# Altium schematic sheet CP80 Preamp.SchDoc
size D; SheetNumber: 1; SheetTotal: 1
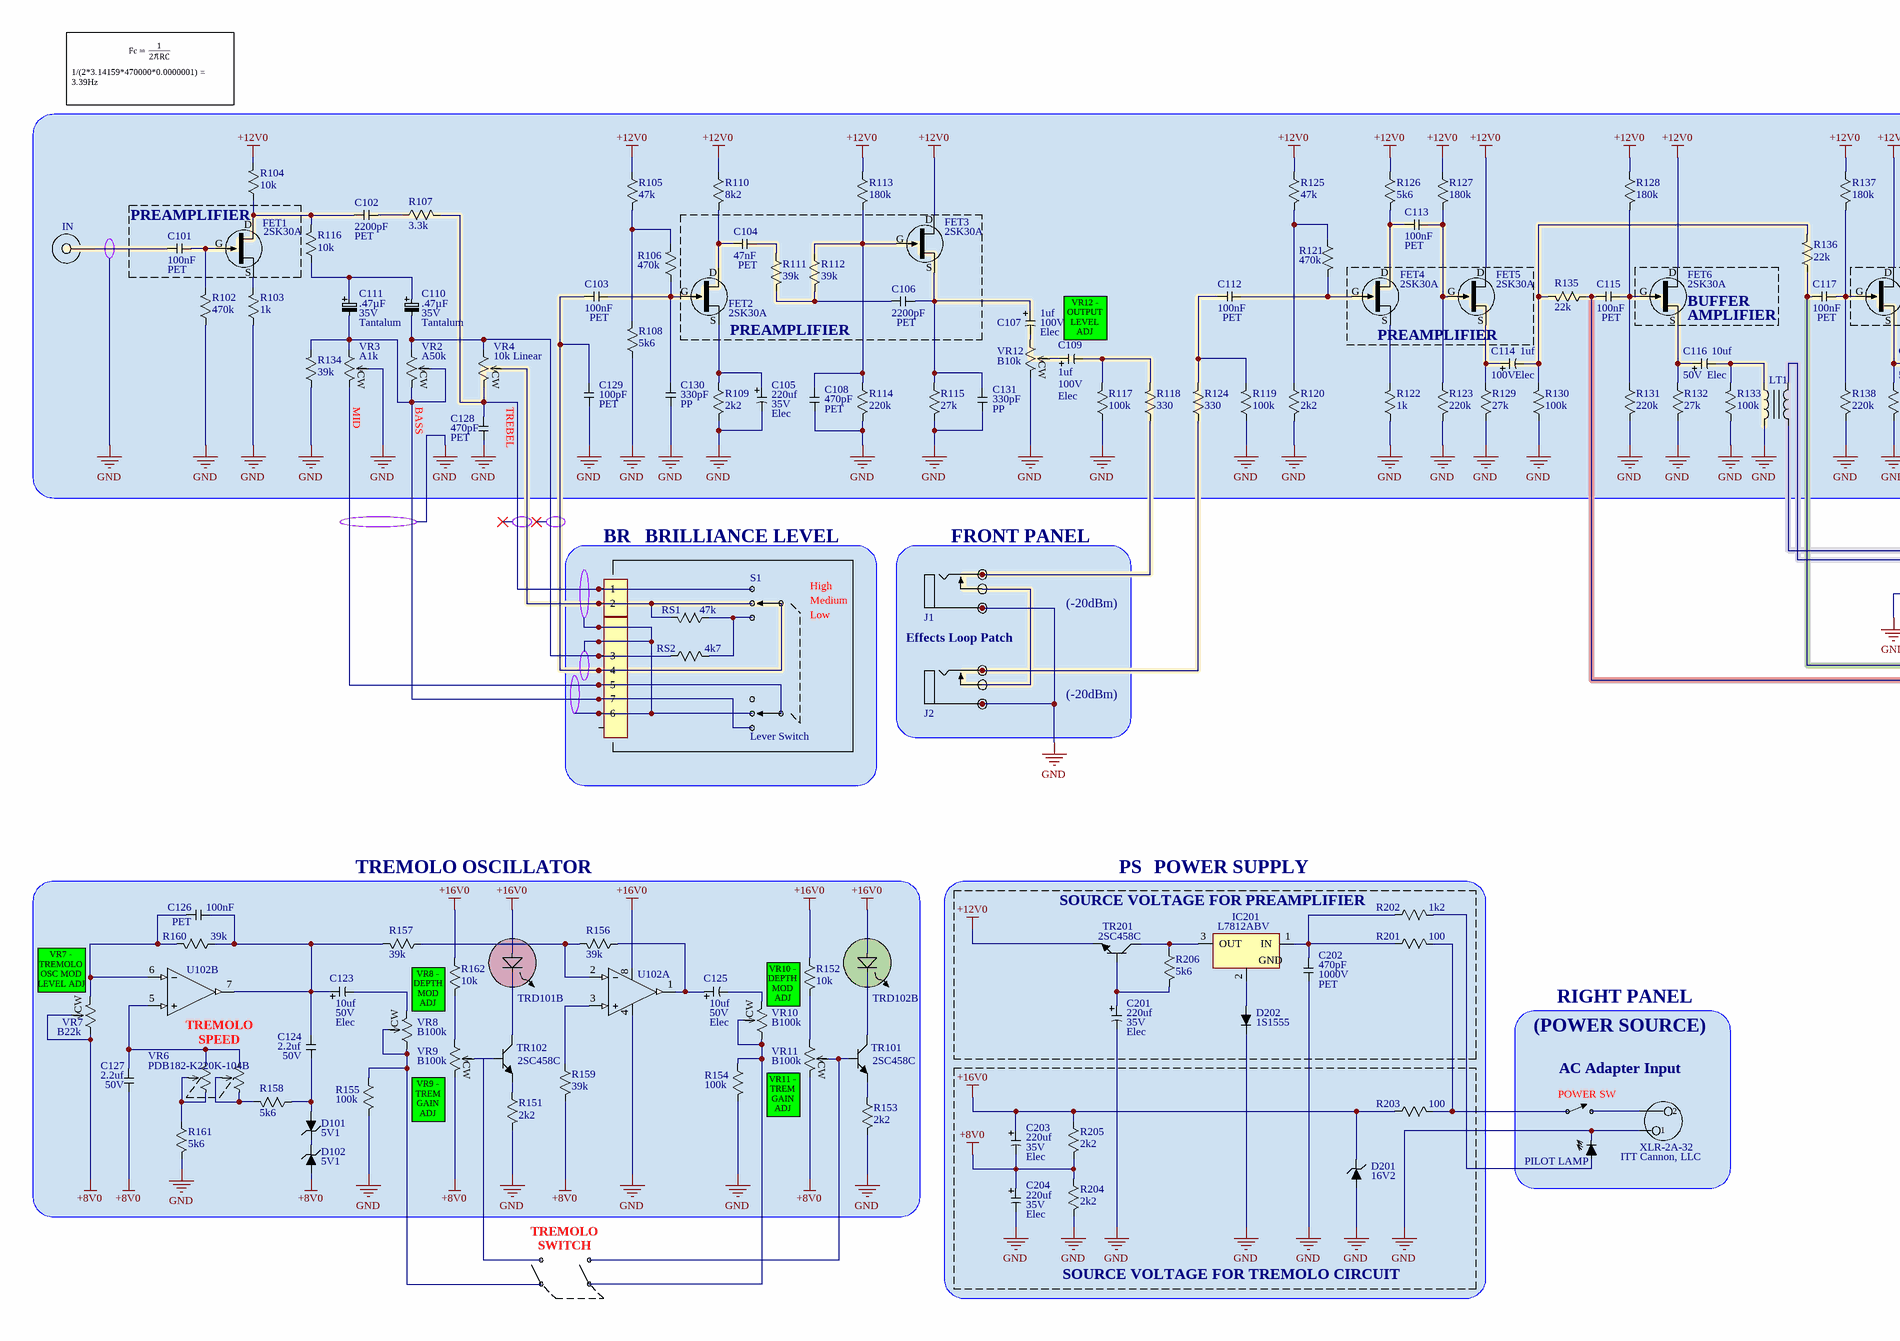
[diagram p0: CP80 Preamp.SchDoc, top left]
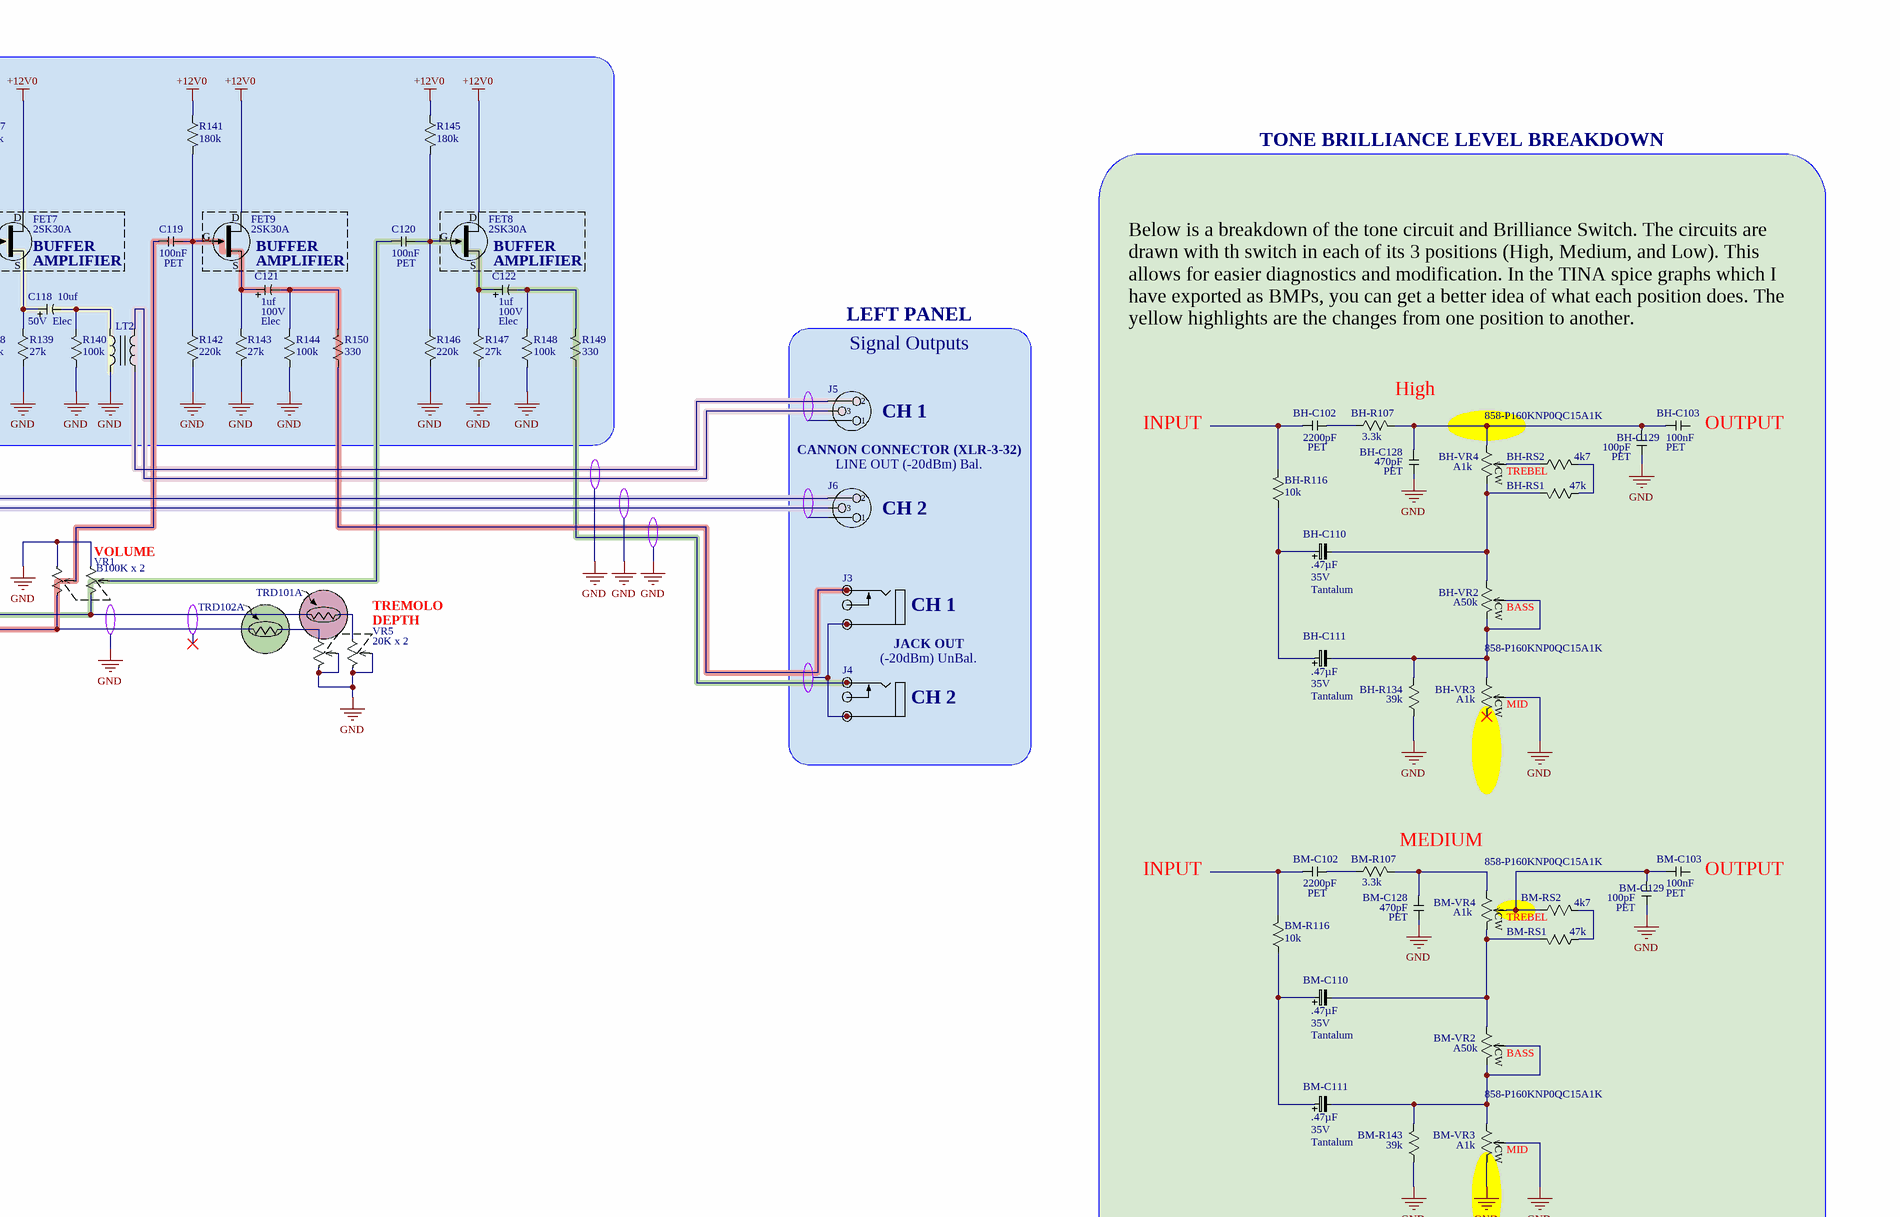
[diagram p1: CP80 Preamp.SchDoc, top right]
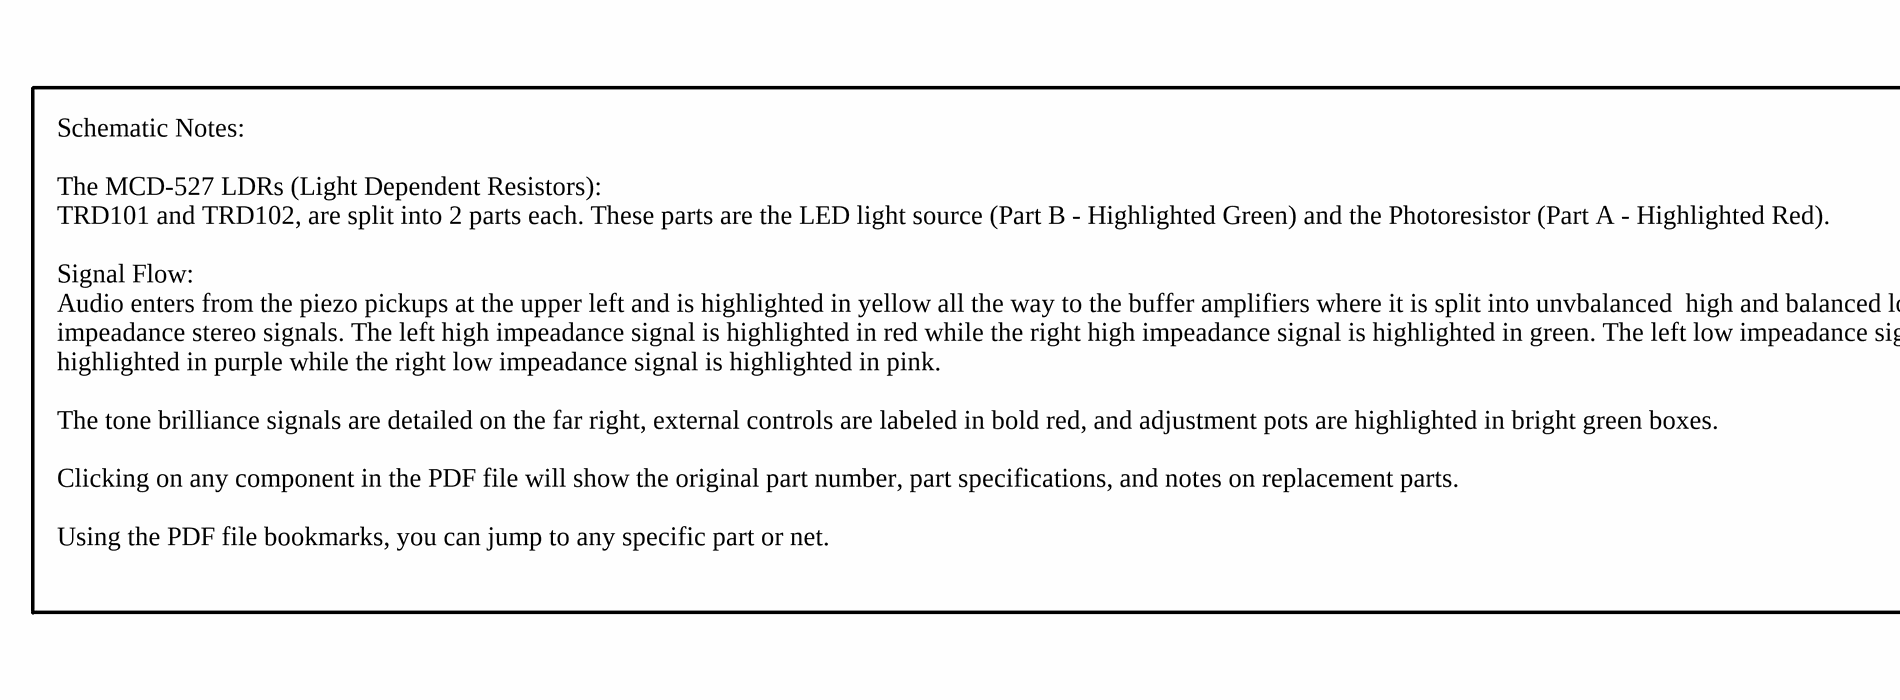
[diagram p2: CP80 Preamp.SchDoc, bottom left]
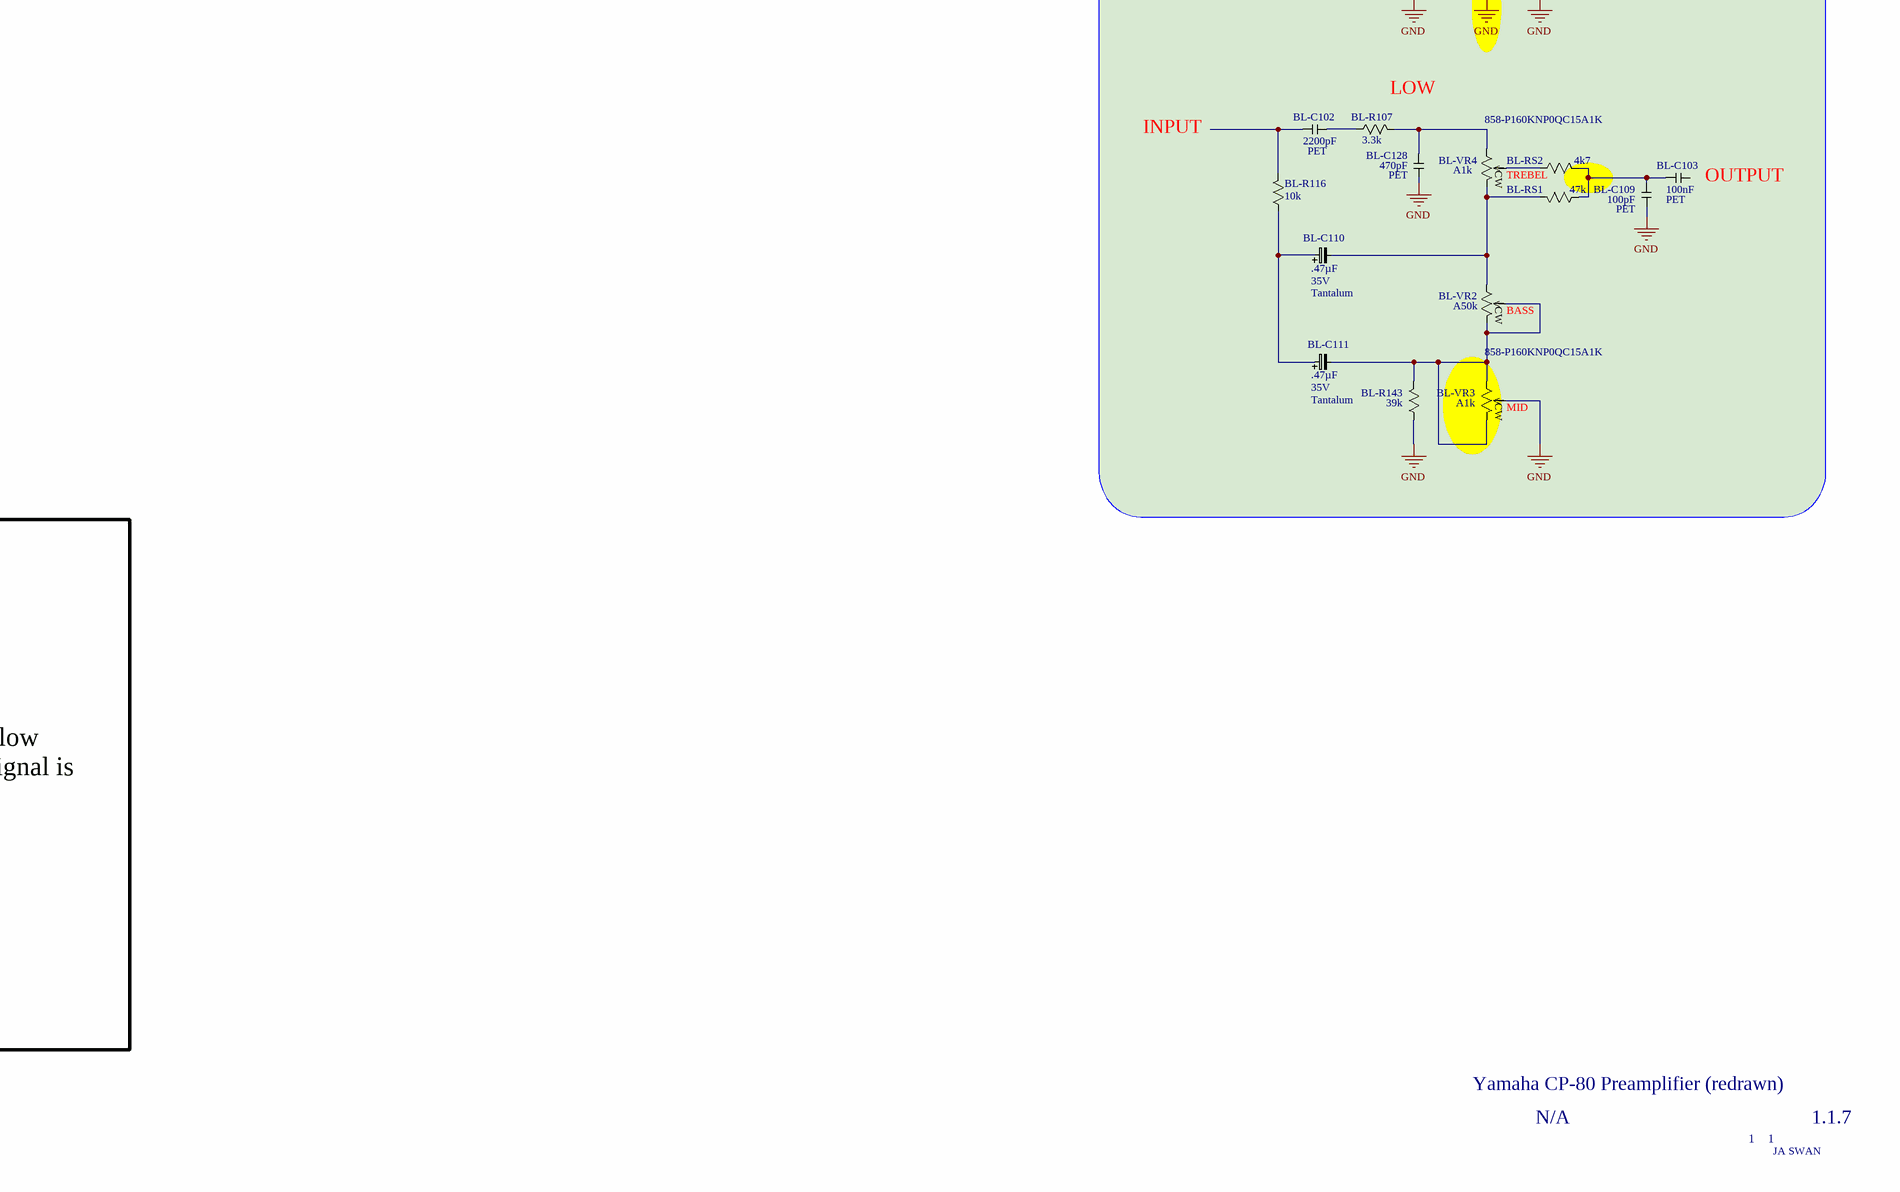
[diagram p3: CP80 Preamp.SchDoc, bottom right]

## Parts
BH-C102  value 2200pF  Capacitor Type: PET  (hidden comment: B32671L1222J000)
BH-C103  value 100nF  Capacitor Type: PET  (hidden comment: ECW-FE2W104JA)
BH-C110  value .47µF  Voltage Rating: 35V  Capacitor Type: Tantalum  (hidden comment: T356A474K035AT)
BH-C111  value .47µF  Voltage Rating: 35V  Capacitor Type: Tantalum  (hidden comment: T356A474K035AT)
BH-C128  value 470pF  Capacitor Type: PET  (hidden comment: R76QF0470DQ00J)
BH-C129  value 100pF  Capacitor Type: PET  (hidden comment: R76UI0100SE40J)
BH-R107  value 3.3k  (hidden comment: MFR-25FTE52-3K3)
BH-R116  value 10k  (hidden comment: MFR-25FTE52-10K)
BH-R134  value 39k  (hidden comment: MFR-25FTE52-39K)
BH-RS1  value 47k  (hidden comment: MFR-25FTE52-47K)
BH-RS2  value 4k7  (hidden comment: MFR-25FTE52-4K7)
BH-VR2  value A50k  (hidden comment: P160KNP-0FC25A50K)
BH-VR3  value A1k  Supplier Part Number 1: 858-P160KNP0QC15A1K  (hidden comment: P160KNP-0QC15A1K)
BH-VR4  value A1k  Supplier Part Number 1: 858-P160KNP0QC15A1K  (hidden comment: P160KNP-0QC15A1K)
BL-C102  value 2200pF  Capacitor Type: PET  (hidden comment: B32671L1222J000)
BL-C103  value 100nF  Capacitor Type: PET  (hidden comment: ECW-FE2W104JA)
BL-C109  value 100pF  Capacitor Type: PET  (hidden comment: R76UI0100SE40J)
BL-C110  value .47µF  Voltage Rating: 35V  Capacitor Type: Tantalum  (hidden comment: T356A474K035AT)
BL-C111  value .47µF  Voltage Rating: 35V  Capacitor Type: Tantalum  (hidden comment: T356A474K035AT)
BL-C128  value 470pF  Capacitor Type: PET  (hidden comment: R76QF0470DQ00J)
BL-R107  value 3.3k  (hidden comment: MFR-25FTE52-3K3)
BL-R116  value 10k  (hidden comment: MFR-25FTE52-10K)
BL-R143  value 39k  (hidden comment: MFR-25FTE52-39K)
BL-RS1  value 47k  (hidden comment: MFR-25FTE52-47K)
BL-RS2  value 4k7  (hidden comment: MFR-25FTE52-4K7)
BL-VR2  value A50k  (hidden comment: P160KNP-0FC25A50K)
BL-VR3  value A1k  Supplier Part Number 1: 858-P160KNP0QC15A1K  (hidden comment: P160KNP-0QC15A1K)
BL-VR4  value A1k  Supplier Part Number 1: 858-P160KNP0QC15A1K  (hidden comment: P160KNP-0QC15A1K)
BM-C102  value 2200pF  Capacitor Type: PET  (hidden comment: B32671L1222J000)
BM-C103  value 100nF  Capacitor Type: PET  (hidden comment: ECW-FE2W104JA)
BM-C110  value .47µF  Voltage Rating: 35V  Capacitor Type: Tantalum  (hidden comment: T356A474K035AT)
BM-C111  value .47µF  Voltage Rating: 35V  Capacitor Type: Tantalum  (hidden comment: T356A474K035AT)
BM-C128  value 470pF  Capacitor Type: PET  (hidden comment: R76QF0470DQ00J)
BM-C129  value 100pF  Capacitor Type: PET  (hidden comment: R76UI0100SE40J)
BM-R107  value 3.3k  (hidden comment: MFR-25FTE52-3K3)
BM-R116  value 10k  (hidden comment: MFR-25FTE52-10K)
BM-R143  value 39k  (hidden comment: MFR-25FTE52-39K)
BM-RS1  value 47k  (hidden comment: MFR-25FTE52-47K)
BM-RS2  value 4k7  (hidden comment: MFR-25FTE52-4K7)
BM-VR2  value A50k  (hidden comment: P160KNP-0FC25A50K)
BM-VR3  value A1k  Supplier Part Number 1: 858-P160KNP0QC15A1K  (hidden comment: P160KNP-0QC15A1K)
BM-VR4  value A1k  Supplier Part Number 1: 858-P160KNP0QC15A1K  (hidden comment: P160KNP-0QC15A1K)
C101  value 100nF  Capacitor Type: PET  (hidden comment: ECW-FE2W104JA)
C102  value 2200pF  Capacitor Type: PET  (hidden comment: B32671L1222J000)
C103  value 100nF  Capacitor Type: PET  (hidden comment: ECW-FE2W104JA)
C104  value 47nF  Capacitor Type: PET  (hidden comment: R76MF24705050J)
C105  value 220uf  Voltage Rating: 35V  Capacitor Type: Elec  (hidden comment: UKT1V221MPD)
C106  value 2200pF  Capacitor Type: PET  (hidden comment: B32671L1222J000)
C107  value 1uf  Voltage Rating: 100V  Capacitor Type: Elec  (hidden comment: 105BPS100M)
C108  value 470pF  Capacitor Type: PET  (hidden comment: R76QF0470DQ00J)
C109  value 1uf  Voltage Rating: 100V  Capacitor Type: Elec  (hidden comment: 105BPS100M)
C110  value .47µF  Voltage Rating: 35V  Capacitor Type: Tantalum  (hidden comment: T356A474K035AT)
C111  value .47µF  Voltage Rating: 35V  Capacitor Type: Tantalum  (hidden comment: T356A474K035AT)
C112  value 100nF  Capacitor Type: PET  (hidden comment: ECW-FE2W104JA)
C113  value 100nF  Capacitor Type: PET  (hidden comment: ECW-FE2W104JA)
C114  value 1uf  Voltage Rating: 100V  Capacitor Type: Elec  (hidden comment: 105BPS100M)
C115  value 100nF  Capacitor Type: PET  (hidden comment: ECW-FE2W104JA)
C116  value 10uf  Voltage Rating: 50V  Capacitor Type: Elec  (hidden comment: UES1H100MPM)
C117  value 100nF  Capacitor Type: PET  (hidden comment: ECW-FE2W104JA)
C118  value 10uf  Voltage Rating: 50V  Capacitor Type: Elec  (hidden comment: UES1H100MPM)
C119  value 100nF  Capacitor Type: PET  (hidden comment: ECW-FE2W104JA)
C120  value 100nF  Capacitor Type: PET  (hidden comment: ECW-FE2W104JA)
C121  value 1uf  Voltage Rating: 100V  Capacitor Type: Elec  (hidden comment: 105BPS100M)
C122  value 1uf  Voltage Rating: 100V  Capacitor Type: Elec  (hidden comment: 105BPS100M)
C123  value 10uf  Voltage Rating: 50V  Capacitor Type: Elec  (hidden comment: UES1H100MPM)
C124  value 2.2uf  Voltage Rating: 50V  (hidden comment: 225BPS050M)
C125  value 10uf  Voltage Rating: 50V  Capacitor Type: Elec  (hidden comment: UES1H100MPM)
C126  value 100nF  Capacitor Type: PET  (hidden comment: ECW-FE2W104JA)
C127  value 2.2uf  Voltage Rating: 50V  (hidden comment: 225BPS050M)
C128  value 470pF  Capacitor Type: PET  (hidden comment: R76QF0470DQ00J)
C129  value 100pF  Capacitor Type: PET  (hidden comment: R76UI0100SE40J)
C130  value 330pF  Capacitor Type: PP  (hidden comment: PFR5331J630J11L4BULK)
C131  value 330pF  Capacitor Type: PP  (hidden comment: PFR5331J630J11L4BULK)
C201  value 220uf  Voltage Rating: 35V  Capacitor Type: Elec  (hidden comment: UKT1V221MPD)
C202  value 470pF  Voltage Rating: 1000V  Capacitor Type: PET  (hidden comment: R76QF0470DQ00J)
C203  value 220uf  Voltage Rating: 35V  Capacitor Type: Elec  (hidden comment: UKT1V221MPD)
C204  value 220uf  Voltage Rating: 35V  Capacitor Type: Elec  (hidden comment: UKT1V221MPD)
D1  Function: PILOT LAMP  [LED_SMD_0805]  (hidden comment: WP7113ID)
D101  Voltage - Zener (Nom): 5V1  [SODFL250X100-2N]  (hidden comment: 1N5231BTR)
D102  Voltage - Zener (Nom): 5V1  [SODFL250X100-2N]  (hidden comment: 1N5231BTR)
D201  Voltage - Zener (Nom): 16V2  [SODFL250X100-2N]  (hidden comment: 1N5246B)
D202  Part Number: 1S1555  (hidden comment: 1N4148)
FET1  Part Number: 2SK30A  [TO92]  (hidden comment: Transistor, JFET, N Ch, TO-92)
FET2  Part Number: 2SK30A  [TO92]  (hidden comment: Transistor, JFET, N Ch, TO-92)
FET3  Part Number: 2SK30A  [TO92]  (hidden comment: Transistor, JFET, N Ch, TO-92)
FET4  Part Number: 2SK30A  [TO92]  (hidden comment: Transistor, JFET, N Ch, TO-92)
FET5  Part Number: 2SK30A  [TO92]  (hidden comment: Transistor, JFET, N Ch, TO-92)
FET6  Part Number: 2SK30A  [TO92]  (hidden comment: Transistor, JFET, N Ch, TO-92)
FET7  Part Number: 2SK30A  [TO92]  (hidden comment: Transistor, JFET, N Ch, TO-92)
FET8  Part Number: 2SK30A  [TO92]  (hidden comment: Transistor, JFET, N Ch, TO-92)
FET9  Part Number: 2SK30A  [TO92]  (hidden comment: Transistor, JFET, N Ch, TO-92)
IC201  L7812ABV  [TO220]
IN  Soldered Wire - Round Pad  [12AWG Soldered Wire - Round]  (value not drawn)  (no BOM)
J1  112AX  (value not drawn)
J2  112AX  (value not drawn)
J3  112AX  (value not drawn)
J4  112AX  (value not drawn)
J5  XLR-3-32  (value not drawn)
J6  XLR-3-32  (value not drawn)
J7  HDR2x1  [HDR1X2]  (value not drawn)  (graphical)
J8  HRD8x1  [HDR1X8]  (value not drawn)  (graphical)
J201  Manufacturer: ITT Cannon, LLC  [SODFL370X135-2N]  (hidden comment: XLR-2A-32)
LT1  GD90025  [SODFL370X135-2N]  (value not drawn)
LT2  GD90025  [SODFL370X135-2N]  (value not drawn)
PS1  POWER SW
R102  value 470k  (hidden comment: MFR-25FTE52-470K)
R103  value 1k  (hidden comment: MFR-25FTE52-1K)
R104  value 10k  (hidden comment: MFR-25FTE52-10K)
R105  value 47k  (hidden comment: MFR-25FTE52-47K)
R106  value 470k  (hidden comment: MFR-25FTE52-470K)
R107  value 3.3k  (hidden comment: MFR-25FTE52-3K3)
R108  value 5k6  (hidden comment: MFR-25FTE52-5K6)
R109  value 2k2  (hidden comment: MFR-25FTE52-2K2)
R110  value 8k2  (hidden comment: MFR-25FTE52-8K2)
R111  value 39k  (hidden comment: MFR-25FTE52-39K)
R112  value 39k  (hidden comment: MFR-25FTE52-39K)
R113  value 180k  (hidden comment: MFR-25FTE52-180K)
R114  value 220k  (hidden comment: MFR-25FTE52-220K)
R115  value 27k  (hidden comment: MFR-25FTE52-27K)
R116  value 10k  (hidden comment: MFR-25FTE52-10K)
R117  value 100k  (hidden comment: MFR-25FTE52-100K)
R118  value 330  (hidden comment: MFR-25FTE52-330R)
R119  value 100k  (hidden comment: MFR-25FTE52-100K)
R120  value 2k2  (hidden comment: MFR-25FTE52-2K2)
R121  value 470k  (hidden comment: MFR-25FTE52-470K)
R122  value 1k  (hidden comment: MFR-25FTE52-1K)
R123  value 220k  (hidden comment: MFR-25FTE52-220K)
R124  value 330  (hidden comment: MFR-25FTE52-330R)
R125  value 47k  (hidden comment: MFR-25FTE52-47K)
R126  value 5k6  (hidden comment: MFR-25FTE52-5K6)
R127  value 180k  (hidden comment: MFR-25FTE52-180K)
R128  value 180k  (hidden comment: MFR-25FTE52-180K)
R129  value 27k  (hidden comment: MFR-25FTE52-27K)
R130  value 100k  (hidden comment: MFR-25FTE52-100K)
R131  value 220k  (hidden comment: MFR-25FTE52-220K)
R132  value 27k  (hidden comment: MFR-25FTE52-27K)
R133  value 100k  (hidden comment: MFR-25FTE52-100K)
R134  value 39k  (hidden comment: MFR-25FTE52-39K)
R135  value 22k  (hidden comment: MFR-25FTE52-22K)
R136  value 22k  (hidden comment: MFR-25FTE52-22K)
R137  value 180k  (hidden comment: MFR-25FTE52-180K)
R138  value 220k  (hidden comment: MFR-25FTE52-220K)
R139  value 27k  (hidden comment: MFR-25FTE52-27K)
R140  value 100k  (hidden comment: MFR-25FTE52-100K)
R141  value 180k  (hidden comment: MFR-25FTE52-180K)
R142  value 220k  (hidden comment: MFR-25FTE52-220K)
R143  value 27k  (hidden comment: MFR-25FTE52-27K)
R144  value 100k  (hidden comment: MFR-25FTE52-100K)
R145  value 180k  (hidden comment: MFR-25FTE52-180K)
R146  value 220k  (hidden comment: MFR-25FTE52-220K)
R147  value 27k  (hidden comment: MFR-25FTE52-27K)
R148  value 100k  (hidden comment: MFR-25FTE52-100K)
R149  value 330  (hidden comment: MFR-25FTE52-330R)
R150  value 330  (hidden comment: MFR-25FTE52-330R)
R151  value 2k2  (hidden comment: MFR-25FTE52-2K2)
R152  value 10k  (hidden comment: MFR-25FTE52-10K)
R153  value 2k2  (hidden comment: MFR-25FTE52-2K2)
R154  value 100k  (hidden comment: MFR-25FTE52-100K)
R155  value 100k  (hidden comment: MFR-25FTE52-100K)
R156  value 39k  (hidden comment: MFR-25FTE52-39K)
R157  value 39k  (hidden comment: MFR-25FTE52-39K)
R158  value 5k6  (hidden comment: MFR-25FTE52-5K6)
R159  value 39k  (hidden comment: MFR-25FTE52-39K)
R160  value 39k  (hidden comment: MFR-25FTE52-39K)
R161  value 5k6  (hidden comment: MFR-25FTE52-5K6)
R162  value 10k  (hidden comment: MFR-25FTE52-10K)
R201  value 100  (hidden comment: MFR-25FTE52-100R)
R202  value 1k2  (hidden comment: MFR-25FTE52-1K2)
R203  value 100  (hidden comment: MFR-25FTE52-100R)
R204  value 2k2  (hidden comment: MFR-25FTE52-2K2)
R205  value 2k2  (hidden comment: MFR-25FTE52-2K2)
R206  value 5k6  (hidden comment: MFR-25FTE52-5K6)
RS1  value 47k  (hidden comment: MFR-25FTE52-47K)
RS2  value 4k7  (hidden comment: MFR-25FTE52-4K7)
S1  Lever Switch
S2  Switch, Toggle, DPST  (value not drawn)
TR101  Part Number: 2SC458C  [SOT95P237X111-3N]  (hidden comment: BC549BTA)
TR102  Part Number: 2SC458C  [SOT95P237X111-3N]  (hidden comment: BC549BTA)
TR201  Part Number: 2SC458C  [SOT95P237X111-3N]  (hidden comment: BC549BTA)
TRD101  NSL-32SR2S  [SODFL370X135-2N]  (value not drawn)  (parts A,B of 2)
TRD102  NSL-32SR2S  [SODFL370X135-2N]  (value not drawn)  (parts A,B of 2)
U102  RC4558IP  (value not drawn)  (parts A,B of 2)
VR1  value B100K x 2  [SODFL370X135-2N]  (hidden comment: PDB182-K220K-104B)
VR2  value A50k  (hidden comment: P160KNP-0FC25A50K)
VR3  value A1k  (hidden comment: P160KNP-0QC15A1K)
VR4  value 10k Linear  [SMD RES 1kO 20% .250W 200V 2420-Footprint-1]  (hidden comment: P160KN-0QD15B10K)
VR5  value 20K x 2  [SODFL370X135-2N]  (hidden comment: P092N-QC20BR20K)
VR6  PDB182-K220K-104B  [SODFL370X135-2N]
VR7  value B22k  [SMD RES 1kO 20% .250W 200V 2420-Footprint-1]  (hidden comment: 3266W-1-253LF)
VR8  value B100k  (hidden comment: 3266W-1-104LF)
VR9  value B100k  (hidden comment: 3266W-1-104LF)
VR10  value B100k  (hidden comment: 3266W-1-104LF)
VR11  value B100k  (hidden comment: 3266W-1-104LF)
VR12  value B10k  (hidden comment: 3266W-1-103LF)

## Blocks framed on the sheet
PREAMPLIFIER: C101 FET1
PREAMPLIFIER: C104 C106 FET2 FET3 R111 R112
PREAMPLIFIER: FET4 FET5
FRONT PANEL: J1 J2
TREMOLO OSCILLATOR: C123-C127 D101 D102 R151-R162 TR101 TR102 TRD101 TRD102 U102 VR6-VR11
SOURCE VOLTAGE FOR PREAMPLIFIER: C201 C202 D202 IC201 R201 R202 R206 TR201
SOURCE VOLTAGE FOR TREMOLO CIRCUIT: C203 C204 D201 R203-R205

## Nets
+8V0: C127.1 C203.N C204.P D102.A R159.2 R204.1 R205.2 VR7.1 VR7.2 VR9.3 VR11.3
+12V0: FET3.3(D) FET5.3(D) FET6.3(D) FET7.3(D) FET8.3(D) FET9.3(D) R104.2 R105.1 R110.1 R113.1 R125.1 R126.1 R127.1 R128.1 R137.1 R141.1 R145.1 TR201.2
+16V0: C203.P D201.C R152.1 R162.1 R203.1 R205.1 TRD101.3 TRD102.3 U102.8
GND: BH-C128.1 BH-C129.1 BH-R134.1 BH-VR3.2 BL-C109.1 BL-C128.1 BL-R143.1 BL-VR3.2 BM-C128.1 BM-C129.1 BM-R143.1 BM-VR3.2 BM-VR3.3 C105.N C108.1 C128.1 C129.1 C130.1 C131.1 C201.N C202.1 C204.N D1.2(K) D201.A D202.C J1.1 J1.3 J2.1 J2.3 J201.0 LT1.0 LT2.0 R102.1 R103.1 R108.1 R109.2 R114.2 R115.2 R117.1 R119.1 R120.2 R122.1 R123.2 R129.2 R130.1 R131.2 R132.2 R133.1 R134.1 R138.2 R139.2 R140.1 R142.2 R143.2 R144.1 R146.2 R147.2 R148.1 R151.2 R153.2 R154.2 R155.2 R161.2 R204.2 U102.4 VR1.0 VR3.2 VR5.0 VR12.3
NetBH-C102_1: BH-C102.1 BH-R116.2
NetBH-C102_2: BH-C102.2 BH-R107.1
NetBH-C103_1: BH-C103.1 BH-C128.2 BH-C129.2 BH-R107.2 BH-VR4.1
NetBH-C110_N: BH-C110.N BH-RS1.2 BH-VR2.1 BH-VR4.3
NetBH-C110_P: BH-C110.P BH-C111.P BH-R116.1
NetBH-C111_N: BH-C111.N BH-R134.2 BH-VR2.2 BH-VR2.3 BH-VR3.1
NetBH-RS1_1: BH-RS1.1 BH-RS2.2
NetBH-RS2_1: BH-RS2.1 BH-VR4.2
NetBL-C102_1: BL-C102.1 BL-R116.2
NetBL-C102_2: BL-C102.2 BL-R107.1
NetBL-C103_1: BL-C103.1 BL-C109.2 BL-RS1.1 BL-RS2.2
NetBL-C110_N: BL-C110.N BL-RS1.2 BL-VR2.1 BL-VR4.3
NetBL-C110_P: BL-C110.P BL-C111.P BL-R116.1
NetBL-C111_N: BL-C111.N BL-R143.2 BL-VR2.2 BL-VR2.3 BL-VR3.1 BL-VR3.3
NetBL-C128_2: BL-C128.2 BL-R107.2 BL-VR4.1
NetBL-RS2_1: BL-RS2.1 BL-VR4.2
NetBM-C102_1: BM-C102.1 BM-R116.2
NetBM-C102_2: BM-C102.2 BM-R107.1
NetBM-C103_1: BM-C103.1 BM-C129.2 BM-RS2.1 BM-VR4.2
NetBM-C110_N: BM-C110.N BM-RS1.2 BM-VR2.1 BM-VR4.3
NetBM-C110_P: BM-C110.P BM-C111.P BM-R116.1
NetBM-C111_N: BM-C111.N BM-R143.2 BM-VR2.2 BM-VR2.3 BM-VR3.1
NetBM-C128_2: BM-C128.2 BM-R107.2 BM-VR4.1
NetBM-RS1_1: BM-RS1.1 BM-RS2.2
NetC101_1: C101.1 IN.1
NetC101_2: C101.2 FET1.2(G) R102.2
NetC102_1: C102.1 FET1.3(D) R104.1 R116.2
NetC102_2: C102.2 R107.1
NetC103_1: C103.1 C129.2 J8.4 S1.0
NetC103_2: C103.2 C130.2 FET2.2(G) R106.1
NetC104_1: C104.1 R111.1
NetC104_2: C104.2 FET2.3(D) R110.2
NetC105_P: C105.P FET2.1(S) R109.1
NetC106_1: C106.1 C107.P C131.2 FET3.1(S) R115.1
NetC106_2: C106.2 R111.2 R112.2
NetC107_N: C107.N VR12.1
NetC108_2: C108.2 FET3.2(G) R112.1 R113.2 R114.1
NetC109_N: C109.N R117.2 R118.2
NetC109_P: C109.P VR12.2
NetC110_N: C110.N J8.3 RS2.1 VR2.1 VR4.1
NetC110_P: C110.P C111.P R116.1
NetC111_N: C111.N J8.7 R134.2 S1.2 VR2.2 VR2.3 VR3.1
NetC112_1: C112.1 R119.2 R124.2
NetC112_2: C112.2 FET4.2(G) R121.2
NetC113_1: C113.1 FET4.3(D) R126.2
NetC113_2: C113.2 FET5.2(G) R123.1 R127.2
NetC114_N: C114.N R130.2 R135.2 R136.2
NetC114_P: C114.P FET5.1(S) R129.1
NetC115_1: C115.1 R135.1 TRD102.1 VR1.1
NetC115_2: C115.2 FET6.2(G) R128.2 R131.1
NetC116_N: C116.N LT1.1 R133.2
NetC116_P: C116.P FET6.1(S) R132.1
NetC117_1: C117.1 R136.1 TRD101.1 VR1.1
NetC117_2: C117.2 FET7.2(G) R137.2 R138.1
NetC118_N: C118.N LT2.1 R140.2
NetC118_P: C118.P FET7.1(S) R139.1
NetC119_1: C119.1 VR1.0
NetC119_2: C119.2 FET9.2(G) R141.2 R142.1
NetC120_1: C120.1 VR1.0
NetC120_2: C120.2 FET8.2(G) R145.2 R146.1
NetC121_N: C121.N R144.2 R150.2
NetC121_P: C121.P FET9.1(S) R143.1
NetC122_N: C122.N R148.2 R149.2
NetC122_P: C122.P FET8.1(S) R147.1
NetC123_N: C123.N VR8.3
NetC123_P: C123.P C124.2 C126.2 R157.2 R160.1 U102.7(OUT2)
NetC124_1: C124.1 D101.A R158.1
NetC125_N: C125.N VR10.3
NetC125_P: C125.P R156.1 U102.1(OUT1)
NetC126_1: C126.1 R160.2 U102.6(IN2-) VR7.3
NetC127_2: C127.2 U102.5(IN2+) VR6.0
NetC128_2: C128.2 J7.1 R107.2 S1.2 VR4.3
NetC201_P: C201.P R206.2 TR201.1
NetC202_2: C202.2 IC201.1(IN) R201.1 R202.1
NetD1_1: D1.1(A) R202.2
NetD101_C: D101.C D102.C
NetD202_A: D202.A IC201.2(GND)
NetFET1_1: FET1.1(S) R103.2
NetFET4_1: FET4.1(S) R122.2
NetIC201_3: IC201.3(OUT) R206.1 TR201.3
NetJ1_2: J1.2 J1.3 R118.1
NetJ1_3: J1.3 J2.3
NetJ2_2: J2.2 J2.3 R124.1
NetJ3_1: J3.1 J3.3 J4.1 J4.3
NetJ3_2: J3.2 J3.3 R150.1
NetJ4_2: J4.2 J4.3 R149.1
NetJ5_0: J5.0 LT2.0
NetJ5_0: J5.0 LT2.1  [a separate net that carries the same name]
NetJ6_0: J6.0 LT1.0
NetJ6_0: J6.0 LT1.1  [a separate net that carries the same name]
NetJ7_2: J7.2 RS1.2 S1.2 VR4.2
NetJ8_1: J8.1 J8.2 J8.6 S1.2
NetJ8_5: J8.5 S1.1 VR3.3
NetJ201_0: J201.0 PS1.0
NetPS1_1: PS1.1 R201.2 R203.2
NetR105_2: R105.2 R106.2 R108.2
NetR120_1: R120.1 R121.1 R125.2
NetR151_1: R151.1 TR102.2
NetR152_2: R152.2 VR11.1
NetR153_1: R153.1 TR101.2
NetR154_1: R154.1 S2.1 VR10.1 VR10.2
NetR155_1: R155.1 S2.1 VR8.1 VR8.2
NetR156_2: R156.2 R157.1 U102.2(IN1-)
NetR158_2: R158.2 VR6.0 VR6.1
NetR159_1: R159.1 U102.3(IN1+)
NetR161_1: R161.1 VR6.0 VR6.1
NetR162_2: R162.2 VR9.1
NetRS1_1: RS1.1 RS2.2 S1.2
NetS2_0: S2.0 TR102.1 VR9.2
NetS2_0: S2.0 TR101.1 VR11.2  [a separate net that carries the same name]
NetTR101_3: TR101.3 TRD102.2
NetTR102_3: TR102.3 TRD101.2
NetTRD101_0: TRD101.0 VR5.1
NetTRD102_0: TRD102.0 VR5.1

Not connected (* = marked no-connect by the designer): BH-C103 2; BH-VR3 3*; BL-C103 2; BM-C103 2; J8 8

## Notes on the sheet
- 1/(2*3.14159*470000*0.0000001) = 3.39Hz
  Cutoff Freq is where Xc = R (470k)
- TONE BRILLIANCE LEVEL BREAKDOWN
- (near FET6) BUFFER
- (near FET7) BUFFER
- (near FET9) BUFFER
- (near FET8) BUFFER
- VR12 - OUTPUT LEVEL ADJ
- (near FET6) AMPLIFIER
- (near FET7) AMPLIFIER
- AMPLIFIER
- LEFT PANEL
- (near VR3) MID
- (near VR2) BASS
- TREBEL
- (near J5) Signal Outputs
- Below is a breakdown of the tone circuit and Brilliance Switch. The circuits are drawn with th switch in each of its 3 positions (High, Medium, and Low). This allows for easier diagnostics and modification. In the TINA spice graphs which I have exported as BMPs, you can get a better idea of what each position does. The yellow highlights are the changes from one position to another.
- (near J5) CH 1
- INPUT
- (near BH-R107) High
- (near BH-C103) OUTPUT
- (near J7) BR
- (near S1) BRILLIANCE LEVEL
- (near J5) CANNON CONNECTOR (XLR-3-32)
- LINE OUT (-20dBm) Bal.
- (near S1) High
- (near S1) Medium
- (-20dBm)
- (near VR1) VOLUME
- (near J6) CH 2
- (near S1) Low
- Effects Loop Patch
- (near VR5) DEPTH
- TREMOLO
- CH 1
- (near BH-VR2) BASS
- JACK OUT
- (-20dBm) UnBal.
- CH 2
- (near BH-VR3) MID
- PS
- POWER SUPPLY
- (near BM-R107) MEDIUM
- (near BM-C103) OUTPUT
- (near VR7) VR7 - TREMOLO OSC MOD LEVEL ADJ
- (near U102) TREMOLO
- SPEED
- VR8 - DEPTH MOD ADJ
- VR10 - DEPTH MOD ADJ
- (POWER SOURCE)
- RIGHT PANEL
- AC Adapter Input
- (near VR9) VR9 - TREM GAIN ADJ
- (near VR11) VR11 - TREM GAIN ADJ
- (near BM-VR2) BASS
- (near BM-VR3) MID
- (near S2) TREMOLO
- (near S2) SWITCH
- (near BL-R107) LOW
- (near BL-C103) OUTPUT
- (near BL-VR2) BASS
- (near BL-VR3) MID
- Schematic Notes:
  The MCD-527 LDRs (Light Dependent Resistors):
  TRD101 and TRD102, are split into 2 parts each. These parts are the LED light source (Part B - Highlighted Green) and the Photoresistor (Part A - Highlighted Red).
  Signal Flow:
  Audio enters from the piezo pickups at the upper left and is highlighted in yellow all the way to the buffer amplifiers where it is split into unvbalanced  high and balanced low impeadance stereo signals. The left high impeadance signal is highlighted in red while the right high impeadance signal is highlighted in green. The left low impeadance signal is highlighted in purple while the right low impeadance signal is highlighted in pink.
  The tone brilliance signals are detailed on the far right, external controls are labeled in bold red, and adjustment pots are highlighted in bright green boxes.
  Clicking on any component in the PDF file will show the original part number, part specifications, and notes on replacement parts.
  Using the PDF file bookmarks, you can jump to any specific part or net.
- Yamaha CP-80 Preamplifier (redrawn)
- N/A
- 1
- JA SWAN
- 1.1.7
- GPD Project Family
- PCBA Part Number:
- PCB Part Number:
- Design Engineer:
- Architecht:
- Production Engineer:
- Version:
- Last Modified:
- Date:
- Time:
- Sheet:
- DIMENSIONS IN MILLIMETERS
- Commit Number:
- Design Notes:
- Circuit Grouping Classifications:
- Arc Tracking Net Class Directives:
- BISSELL Icon:
- QR Code Icon:
- ESD Icon:
- High Voltage Icon:
- WEEE Icon:
- ROHS Icon:
- Mechanical Features:
- Fiducials:
- (in symbol Connector, XLR, 2 POS, Male Pins) 2; 1
- (in symbol Connector, XLR, 3 POS, Male Pins, Solder Cup) 2; 3; 1
- (in symbol Pot, Single, Cond Plastic, 1k, Log) CW
- (in symbol Pot, Single, Cond Plastic, 10k) CW
- (in symbol Pot, Single, Cond Plastic, 50k, Log) CW
- (in symbol Pot, Trim, Cermet, 10k, Lin) CW
- (in symbol Pot, Trim, Cermet, 25k, Lin) CW
- (in symbol Pot, Trim, Cermet, 100k, Lin) CW

## Library data of the parts
BH-C102 BL-C102 BM-C102 C102 C106 = Cap_Non_Pol_2200pF: 2200pF ±20% 20V (or higher) PET Capacitor / These were originally Mylar Film (PET) but I suggest replacing with metallized polypropylene (MKP / PP). Just ensure a propper lead spacing and fit.; Manufacturer: KEMET; Voltage Rating: 600V; Tolerance: 5%; Supplier 1: DigiKey; Supplier Part Number 1: 495-3206-ND
BH-C103 BL-C103 BM-C103 C101 C103 C112 C113 C115 C117 C119 C120 C126 = Cap_Non_Pol_100nF: 100nF (0.1uf) ±20% 20V (or higher) PET Capacitor / These were originally Mylar Film (PET) but I suggest replacing with metallized polypropylene (MKP / PP). Just ensure a propper lead spacing and fit.; Manufacturer: KEMET; Voltage Rating: 20V; Tolerance: 20%; Supplier 1: DigiKey; Supplier Part Number 1: 10-ECW-FE2W104JA-ND
BH-C110 BH-C111 BL-C110 BL-C111 BM-C110 BM-C111 C110 C111 = Cap_Tant_0u47: .47µF TANT 20% 16V / The originals were most likely 20% @ 16V with an ESR of 50 Ohms @ 100Khz. If replaced I would use 10%, 20V with 5 Ohm ESR @ 100Khz; Manufacturer: KMET; Tolerance: 10%; Case/Package: Radial; Supplier 1: DigiKey; Supplier Part Number 1: 399-3617-ND
BH-C128 BL-C128 BM-C128 C108 C128 = Cap_Non_Pol_470pF: 470pF ±20% 20V (or higher) PET Capacitor / These were originally Mylar Film (PET) but I suggest replacing with metallized polypropylene (MKP / PP). Just ensure a propper lead spacing and fit.; Manufacturer: KMET; Voltage Rating: 1000V; Tolerance: 5%; Supplier 1: DigiKey; Supplier Part Number 1: 399-R76QF0470DQ00JCT-ND
BH-C129 BL-C109 BM-C129 C129 = Cap_Non_Pol_100pF: 100pF ±20% 20V (or higher) PET Capacitor / These were originally Mylar Film (PET) but I suggest replacing with metallized polypropylene (MKP / PP). Just ensure a propper lead spacing and fit.; Manufacturer: KMET; Voltage Rating: 2000V; Tolerance: 5%; Supplier 1: DigiKey; Supplier Part Number 1: 399-R76UI0100SE40J-ND
BH-R107 BL-R107 BM-R107 R107 = Resistor_3k3: 3k3 10% 1/4 Watt Resistor / All resistors are 10% 1/4 Watt. I suggest any replacement use 1% 1/4 Watt metal film.; Manufacturer: Yageo; Power: 250mW; Tolerance: 1%; Supplier 1: DigiKey; Supplier Part Number 1: 13-MFR-25FTE52-3K3CT-ND
BH-R116 BL-R116 BM-R116 R104 R116 R152 R162 = Resistor_10k: 10k 10% 1/4 Watt Resistor / All resistors are 10% 1/4 Watt. I suggest any replacement use 1% 1/4 Watt metal film.; Manufacturer: Yageo; Power: 250mW; Tolerance: 1%; Supplier 1: DigiKey; Supplier Part Number 1: 13-MFR-25FTE52-10KCT-ND
BH-R134 BL-R143 BM-R143 R111 R112 R134 R156 R157 R159 R160 = Resistor_39k: 39k 10% 1/4 Watt Resistor / All resistors are 10% 1/4 Watt. I suggest any replacement use 1% 1/4 Watt metal film.; Manufacturer: Yageo; Power: 250mW; Tolerance: 1%; Supplier 1: DigiKey; Supplier Part Number 1: 13-MFR-25FTE52-39KCT-ND
BH-RS1 BL-RS1 BM-RS1 R105 R125 RS1 = Resistor_47k: 47k 10% 1/4 Watt ResistorAll resistors are 10% 1/4 Watt. / I suggest any replacement use 1% 1/4 Watt metal film.; Manufacturer: Yageo; Power: 250mW; Tolerance: 1%; Supplier 1: DigiKey; Supplier Part Number 1: 13-MFR-25FTE52-47KCT-ND
BH-RS2 BL-RS2 BM-RS2 RS2 = Resistor_4k7: 4k7 10% 1/4 Watt Resistor / All resistors are 10% 1/4 Watt. I suggest any replacement use 1% 1/4 Watt metal film.; Manufacturer: Yageo; Power: 250mW; Tolerance: 1%; Supplier 1: DigiKey; Supplier Part Number 1: 13-MFR-25FTE52-4K7CT-ND
BH-VR2 BL-VR2 BM-VR2 VR2 = Pot, Single, Cond Plastic, 50k, Log: 50k Ohm 1 Gang Logarithmic Through Hole Potentiometer 1.0 Turns Carbon 0.125W, 1/8W PC Pins / Replace with conductive plastic.; Manufacturer: Various; Power: 200mW; Tolerance: 20%; Supplier 1: Mouser; Supplier Part Number 1: 858-P160KNP0FC25A50K
BH-VR3 BH-VR4 BL-VR3 BL-VR4 BM-VR3 BM-VR4 VR3 = Pot, Single, Cond Plastic, 1k, Log: 1k Ohm 1 Gang Logarithmic Through Hole Potentiometer 1.0 Turns Carbon 0.125W, 1/8W PC Pins / Replace with conductive plastic.; Manufacturer: Bourns; Power: 250mW; Tolerance: 20%; Supplier 1: Mouser
  VR3: Supplier Part Number 1: 858-P160KNP0QC15A1K
C104 = Cap_Non_Pol_47nF: 47nF (0.047uf) ±20% 20V (or higher) PET Capacitor / These were originally Mylar Film (PET) but I suggest replacing with metallized polypropylene (MKP / PP). Just ensure a propper lead spacing and fit.; Manufacturer: Various; Voltage Rating: 400V; Tolerance: 5%; Supplier 1: DigiKey; Supplier Part Number 1: 399-R76MF24705050J-ND
C105 C201 C203 C204 = Cap_Pol_220uF_35V: 220µF 20% 25V Electrolytic Capacitor / If replacing, use a good quality 220uF 20% (or better) 25V Electrolytic Capacitor that physically fits correctly; Manufacturer: Generic; Tolerance: 20%; Case/Package: Radial; Supplier 1: DigiKey; Supplier Part Number 1: 493-15452-ND
C107 C109 C114 C121 C122 = Cap_Pol_Elec_1u0_50V: 1uf, 50V, 20%, Electrolytic / If these need replacement, just use a low ESR 1uF, 50V, 10% or 20% Electrolytic that is the correct physical size; Manufacturer: Generic; Tolerance: 20%; Case/Package: Radial; Supplier 1: DigiKey; Supplier Part Number 1: 105BPS100M-ND
C116 C118 C123 C125 = Cap_Pol_10u_50V: 10µF 20% 25V electrolytic Capacitor / If replacing, use a 10uF 10% 50V electrolytic woth a low ESR. Going to 50V will allow for 10% and a lower ESR as long as it still physically fits well.; Manufacturer: Generic; Tolerance: 20%; Case/Package: Radial; Supplier 1: DigiKey; Supplier Part Number 1: 493-15033-ND
C124 C127 = Cap_Non_Pol_2u2_50V: 2.2uF ±20% 16V BiPolar Electrolytic / If these are replaced, be sure to use BiPolar Electrolytics. I would go with ±10% tollerance and a minimum 25V. Just make sure they physically are the correct size.; Manufacturer: Generic; Capacitor Type: BP Elec; Case/Package: Radial; Tolerance: 20%; Supplier 1: DigiKey; Supplier Part Number 1: 225BPS050M-ND
C130 C131 = Cap_Non_Pol_330pF: 330pF ±20% 20V (or higher) PET Capacitor / These were originally Mylar Film (PET) but I suggest replacing with metallized polypropylene (MKP / PP). Just ensure a propper lead spacing and fit.; Manufacturer: Various; Voltage Rating: 250V; Tolerance: 5%; Supplier 1: DigiKey; Supplier Part Number 1: 399-7718-ND
C202 = Cap_Non_Pol_470pF: 470pF ±20% 20V (or higher) PET Capacitor / These were originally Mylar Film (PET) but I suggest replacing with metallized polypropylene (MKP / PP). Just ensure a propper lead spacing and fit.; Manufacturer: KMET; Tolerance: 5%; Supplier 1: DigiKey; Supplier Part Number 1: 399-R76QF0470DQ00JCT-ND
D1 = LED, Red, 5mm: Single Color (Red) LED / If replacing, any standard LED with a forward voltage of 1V7 to 2V2 will work fine; Manufacturer: Various; Voltage - Forward (Max) @ If: 1V7; Supplier 1: DigiKey; Supplier Part Number 1: 754-1264-ND
D101 D102 = Diode, Zener, 5V1, 500mW: Zener Diode 5.1 V 500 mW 5% / If replacing, any 5V1 zener capable of 500mW is fine; Manufacturer: Japan Radio Co LTD; Impedence (Max): 60; Case/Package: Radial; Tolerance: 5%; Power - Max: 500mW; Supplier 1: Mouser; Supplier Part Number 1: 494-1N5231B/TR
D201 = Diode, Zener, 16V2, 500mW: Zener Diode 16V2 500 mW 5% / If replacing, any 16V2 zener with 500mW capability will work.; Manufacturer: Japan Radio Co LTD; Impedence (Max): 20; Power - Max: 500W; Case/Package: Radial; Tolerance: 5%; Supplier 1: DigiKey; Supplier Part Number 1: 1N5246BTRFSCT-ND
D202 = Diode, Gen Purpose: General purpose Rectifier Diode, 300mA, 35V V(RRM) / If replacing and you cannot find the original, a 1N4148 should be fine; Manufacturer: Toshiba; Voltage - Forward (Max) @ If: 1.4V; Current - Average Rectified: 100mA; Voltage - DC Reverse (Max): 35V; Supplier 1: DigiKey; Supplier Part Number 1: 1N4148FS-ND
FET1-FET9 = Transistor, JFET, N Ch, TO-92: Original was an N Channel JFET 2SK30A in a TO-92 Footprint / These have extremely wide tollerances - Always check for correct biasing when replacing. There will be an entire write up on how to do this in the Documents folder; Manufacturer: TOSHIBA; Package: TO92; Supplier 1: Win Source; Supplier Part Number 1: 18270-2SK30A-Y
IC201 = IC, REG, LINEAR, 12V, 1.5A, TO220: Originally a FS7812L Linear Voltage Regulator IC Positive Fixed 1 Output 1.5A TO-220 / If replacing, there are many pin for pin compatible devices; Manufacturer: STMicroelectronics; Package: TO220; Part Number: L7812ABV; Supplier 1: DigiKey; Supplier Part Number 1: 497-1449-5-ND
IN = Soldered Wire - Round: Single connection for a wire using a round pad that allows for insertion from either side; Manufacturer: NA; Gender: Female; System: Connector; Pinout: TH 1x1; Connector Type: Single Wire; Mating Housing: N/A; CUL Cert No.: NA; UL Cert No.: NA; Case/Package: TH 1x1
J1-J4 = Jack, Phone, 2 Pos, Break SW: Phone Jack, 6.35mm (0.250", 1/4", Mono Connector, 1 Switch Contact / If replacing, replace with same high quality; Supplier 1: DigiKey; Supplier Part Number 1: SC1316-ND
J5 J6 = Connector, XLR, 3 POS, Male Pins, Solder Cup: 3 Position Circular Connector Receptacle, Male Pins Solder Cup / Replace with same if replacing; Manufacturer: ITT Cannon, LLC; Part Number: XLR-3-32; Supplier 1: DigiKey; Supplier Part Number 1: 1003-1238-ND
J7 = HDR2x1: 2 pin 0.1" spacing header; Gender: Female; Connector Type: Pin HEader; System: Connector; Pinout: 2x1; Mating Housing: N/A; Manufacturer: N/A; CUL Cert No.: N/A; UL Cert No.: N/A; Case/Package: TH 2x1
J8 = HDR8x1: 8 pin 0.1" header; Manufacturer: Generic; Gender: Male; Pinout: 8x1; System: Connector; Connector Type: Pin Header; CUL Cert No.: N/A; UL Cert No.: N/A; Case/Package: TH 8x1; Mating Housing: N/A
J201 = Connector, XLR, 2 POS, Male Pins: 2 Position Circular Connector Plug, Female Sockets Solder / XLR-2A-32 is the male version on the piano while XLR2A11C Is the female connector on the cable; Part Number: XLR-2A-32; Supplier 1: Master Electronics; Supplier Part Number 1: XLR2A32
LT1 LT2 = Transformer, Audio Matching: The original was a GD90025 - I think these can be replaced with Hammond audio signal transformers... I need to put these on the analyzer to see.; Manufacturer: Diodes Incorporated; Part Number: GD90025
PS1 = Switch, Toggle, SPST: Slide switch. Need to find replacement part number
R102 R106 R121 = Resistor_470k: 470k 10% 1/4 Watt Resistor / All resistors are 10% 1/4 Watt. I suggest any replacement use 1% 1/4 Watt metal film.; Manufacturer: Yageo; Power: 250mW; Tolerance: 1%; Supplier 1: DigiKey; Supplier Part Number 1: 13-MFR-25FTE52-470KCT-ND
R103 R122 = Resistor_1k: 1k 10% 1/4 Watt Resistor / All resistors are 10% 1/4 Watt. I suggest any replacement use 1% 1/4 Watt metal film.; Manufacturer: Yageo; Power: 250mW; Tolerance: 1%; Supplier 1: DigiKey; Supplier Part Number 1: 13-MFR-25FTE52-1KCT-ND
R108 R126 R158 R161 R206 = Resistor_5k6: 5k6 10% 1/4 Watt Resistor / All resistors are 10% 1/4 Watt. I suggest any replacement use 1% 1/4 Watt metal film.; Manufacturer: Yageo; Power: 250mW; Tolerance: 1%; Supplier 1: DigiKey; Supplier Part Number 1: 13-MFR-25FTE52-5K6CT-ND
R109 R120 R151 R153 R204 R205 = Resistor_2k2: 2k2 10% 1/4 Watt Resistor / All resistors are 10% 1/4 Watt. I suggest any replacement use 1% 1/4 Watt metal film.; Manufacturer: Yageo; Power: 250mW; Tolerance: 1%; Supplier 1: DigiKey; Supplier Part Number 1: 13-MFR-25FTE52-2K2CT-ND
R110 = Resistor_8k2: 8k2 10% 1/4 Watt Resistor / All resistors are 10% 1/4 Watt. I suggest any replacement use 1% 1/4 Watt metal film.; Manufacturer: Yageo; Power: 250mW; Tolerance: 1%; Supplier 1: DigiKey; Supplier Part Number 1: 13-MFR-25FTE52-8K2CT-ND
R113 R127 R128 R137 R141 R145 = Resistor_180k: 180k 10% 1/4 Watt Resistor / All resistors are 10% 1/4 Watt. I suggest any replacement use 1% 1/4 Watt metal film.; Manufacturer: Yageo; Power: 250mW; Tolerance: 1%; Supplier 1: DigiKey; Supplier Part Number 1: 13-MFR-25FTE52-180KCT-ND
R114 R123 R131 R138 R142 R146 = Resistor_220k: 220k 10% 1/4 Watt Resistor / All resistors are 10% 1/4 Watt. I suggest any replacement use 1% 1/4 Watt metal film.; Manufacturer: Yageo; Power: 250mW; Tolerance: 1%; Supplier 1: DigiKey; Supplier Part Number 1: 13-MFR-25FTE52-220KCT-ND
R115 R129 R132 R139 R143 R147 = Resistor_27k: 27k 10% 1/4 Watt Resistor / All resistors are 10% 1/4 Watt. I suggest any replacement use 1% 1/4 Watt metal film.; Manufacturer: Yageo; Power: 250mW; Tolerance: 1%; Supplier 1: DigiKey; Supplier Part Number 1: 13-MFR-25FTE52-27KCT-ND
R117 R119 R130 R133 R140 R144 R148 R154 R155 = Resistor_100k: 100k 10% 1/4 Watt Resistor / All resistors are 10% 1/4 Watt. I suggest any replacement use 1% 1/4 Watt metal film.; Manufacturer: Yageo; Power: 250mW; Tolerance: 1%; Supplier 1: DigiKey; Supplier Part Number 1: 13-MFR-25FTE52-100KCT-ND
R118 R124 R149 R150 = Resistor_330: 330 10% 1/4 Watt Resistor / All resistors are 10% 1/4 Watt. I suggest any replacement use 1% 1/4 Watt metal film.; Manufacturer: Yageo; Power: 250mW; Tolerance: 1%; Supplier 1: DigiKey; Supplier Part Number 1: 13-MFR-25FTE52-330RCT-ND
R135 R136 = Resistor_22k: 22k 10% 1/4 Watt Resistor / All resistors are 10% 1/4 Watt. I suggest any replacement use 1% 1/4 Watt metal film.; Manufacturer: Yageo; Power: 250mW; Tolerance: 1%; Supplier 1: DigiKey; Supplier Part Number 1: 13-MFR-25FTE52-22KCT-ND
R201 R203 = Resistor_100: 100 10% 1/4 Watt Resistor / All resistors are 10% 1/4 Watt. I suggest any replacement use 1% 1/4 Watt metal film.; Manufacturer: Yageo; Power: 250mW; Tolerance: 1%; Supplier 1: DigiKey; Supplier Part Number 1: 13-MFR-25FTE52-100RCT-ND
R202 = Resistor_1k2: 1k2 10% 1/4 Watt Resistor / All resistors are 10% 1/4 Watt. I suggest any replacement use 1% 1/4 Watt metal film.; Manufacturer: Yageo; Power: 250mW; Tolerance: 1%; Supplier 1: DigiKey; Supplier Part Number 1: 13-MFR-25FTE52-1K2CT-ND
S1 = Switch, Lever, 2P3T: Lever Switch, 2P3T - Unknown replacement as of yet.; Manufacturer: UNK; Part Number: UNK
S2 = Switch, Toggle, DPST: This is a specialized switch with no known replacement. Will research more.
TR101 TR102 TR201 = Transistor, NPN, 30V, 0.1A, 500mW, TO-92: Small Signal Bipolar Transistor, 0.6A I(C), 40V V(BR)CEO, 1-Element, NPN, Silicon, TO-236 / If replacing, a BC549BTA or equivelant will work fine. These are just for turnming on the LEDs in the LDRs.; Manufacturer: Hitachi; Vce Saturation (Max) @ Ib, Ic: 400mV @ Ic=10mA, Ib 1mA; DC Current Gain (hFE) (Min) @ Ic, Vce: 100 @ Ic=10mA, VCE=1V; Current - Collector Cutoff (Max): 500nA; Power - Max: 200mW; Current - Collector (Ic) (Max): 100mA; Type: NPN; Case/Package: TO-92; Supplier 1: DigiKey; Supplier Part Number 1: BC549BTACT-ND
TRD101 TRD102 = LDR (Light Dependant Resistor): This original part was a MCD-527 LDR (Light Dependent Resistor). / If replacing, the Advanced Photonix NSL-32SR2S OPTOISO PHOTOCELL OPTOCOUPLER is a very close alternative and is available on DigiKey. I will do more research on this (put one in a PreAmp) to see if any other tweaks are necessary.; Manufacturer: Silicon Sensors Inc; Power Dissipation (Max): 90mW; LED Forward Current (Max): 50mA; LED Forward Current (Nom): 30mA; LED Forward Voltage: 1.7V; LED Reverse Voltage (Max): 2.0V; CdS Resistance On: 1K; CdS Resistance Off: 2M; CdS Power (Max): 70mW; CdS Voltage (Max): 150V; Part Number: MCD-527; Supplier 1: DigiKey; Supplier Part Number 1: NSL-32SR2S-ND
U102 = IC, OPAMP, GP, 2 Circuit, 8DIP: Dual General-Purpose Operational Amplifier, 10 to 30 V, 0 to 70 degC, 8-pin SOP (PW8), Green (RoHS & no Sb/Br) / If replacing, replace with the same as removed. These are still available.; PartNumber: RC4558PWR; Manufacturer: Texas Instruments; Number of Channels: 2; Total Supply Voltage(Max)(+5V is 5, +/-5V is 10): 30; Iq per channel(Max)(mA): 2.8; Slew Rate(Typ)(V/us): 1.7; Vio (25C)(Max)(mV): 6; Vn at 1kHz(Typ)(nV/rtHz): 8; GBW(Typ)(MHz): 3; CMRR(Min)(dB): 70; Supplier 1: DigiKey; Supplier Part Number 1: 296-17460-5-ND
VR1 = Pot, Dual, Carbon, 100k, Lin: 100k Ohm 2 Gang Linear Through Hole Potentiometer 1.0 Turns Carbon 0.125W, 1/8W PC Pins / Replace with conductive plastic or cermet if possible. This one is carbon.; Manufacturer: Various; Power: 125mW; Tolerance: 20%; Supplier 1: DigiKey; Supplier Part Number 1: PDB182-K220K-104B-ND
VR4 = Pot, Single, Cond Plastic, 10k: 10k Ohm 1 Gang Linear Through Hole Potentiometer 1.0 Turns Carbon 0.125W, 1/8W PC Pins / Replace with conductive plastic; Manufacturer: Various; Power: .2mW; Tolerance: 20%; Supplier 1: DigiKey; Supplier Part Number 1: 987-1308-ND
VR5 = Pot, Dual, Cermet, 20K: 20k Ohm 2 Gang Linear Through Hole Potentiometer 1.0 Turns Carbon 0.125W, 1/8W PC Pins / Replace with Conductive Plastric or Cermet. Ensure proper mechanical fit.; Manufacturer: Various; Power: 125mW; Tolerance: 20%; Supplier 1: Master Electronics; Supplier Part Number 1: P092N-QC20BR20K; Supplier 2: DigiKey; Supplier 3: Onlinecomponents.com; Supplier Part Number 2: P092N-QC20BR20K-ND; Supplier Part Number 3: P092N-QC20BR20K
VR6 = Pot, Dual, Carbon, 100k, Lin: 100k Ohm 2 Gang Linear Through Hole Potentiometer 1.0 Turns Carbon 0.125W, 1/8W PC Pins / Replace with conductive plastic or cermet if possible. This one is carbon.; Manufacturer: Various; Value: B100K x 2; Power: 125mW; Tolerance: 20%; Supplier 1: DigiKey; Supplier Part Number 1: PDB182-K220K-104B-ND
VR7 = Pot, Trim, Cermet, 25k, Lin: Original was 22k Linear 20% .250W carbon Adjustable Resistor - Trimmer / If replacing, use a 1/4W cermet multi turn with 10% tolerance as they are much better. I am using a 25k as they are much easier to source and it will work just fine. Find a physical size that works... I will do more research on these as I would also (personally) use a multiturn pot if I can find one that fits.; Manufacturer: Various; Power: 250mW; Tolerance: 20%; Supplier 1: DigiKey; Supplier Part Number 1: 3266W-253LF-ND
VR8-VR11 = Pot, Trim, Cermet, 100k, Lin: 100k Linear taper 20% .250W carbon Adjustable Resistor - Trimmer / If replacing, use a 1/4W cermet multi turn with 10% tolerance as they are much better. Find a physical size that works... I will do more research on these as I would also (personally) use a multiturn pot if I can find one that fits.; Manufacturer: Various; Power: 250mW; Tolerance: 20%; Supplier 1: DigiKey; Supplier Part Number 1: 3266W-104LF-ND
VR12 = Pot, Trim, Cermet, 10k, Lin: 10k Linear taper 20% .250W carbon Adjustable Resistor - Trimmer / If replacing, use a 1/4W cermet multi turn with 10% tolerance as they are much better. Find a physical size that works... I will do more research on these as I would also (personally) use a multiturn pot if I can find one that fits.; Manufacturer: Various; Power: 125mw; Tolerance: 20%; Supplier 1: DigiKey; Supplier Part Number 1: 3266W-103LF-ND